# Altium schematic sheet SubsystemD_Schematic.SchDoc
size A4; SheetNumber: 1; SheetTotal: 1
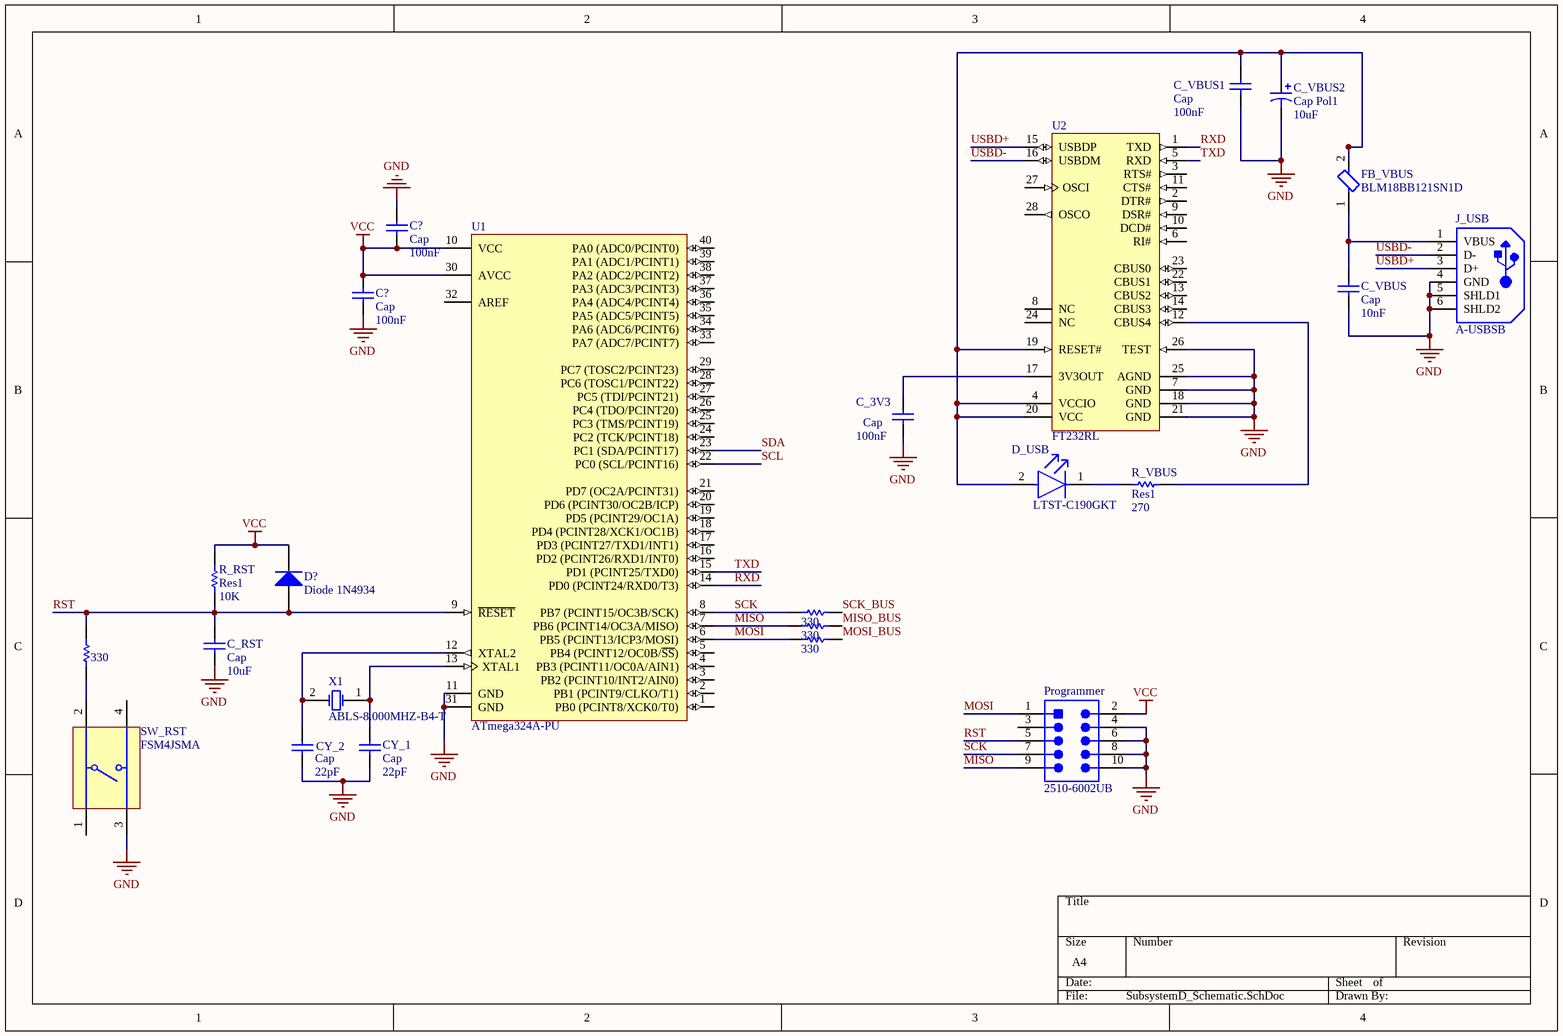
[diagram p0: SubsystemD_Schematic.SchDoc]

## Parts
(Parts that share a designator on the sheet are numbered #1, #2 ... from top to bottom, then left to right.)
BUS_R?#1  value 330  [AXIAL-0.3]  (hidden comment: Res1)
BUS_R?#2  value 330  [AXIAL-0.3]  (hidden comment: Res1)
BUS_R?#3  value 330  [AXIAL-0.3]  (hidden comment: Res1)
BUS_R?#4  value 330  [AXIAL-0.3]  (hidden comment: Res1)
C?#1  Cap  value 100nF  [RAD-0.3]
C?#2  Cap  value 100nF  [RAD-0.3]
C_3V3  Cap  value 100nF  [RAD-0.3]
C_RST  Cap  value 10uF  [RAD-0.3]
C_VBUS  Cap  value 10nF  [RAD-0.3]
C_VBUS1  Cap  value 100nF  [RAD-0.3]
C_VBUS2  Cap Pol1  value 10uF  [RB7.6-15]
CY_1  Cap  value 22pF  [RAD-0.3]
CY_2  Cap  value 22pF  [RAD-0.3]
D?  Diode 1N4934  [DO-41]
D_USB  LTST-C190GKT  [FP-LTST-C190GKT-MFG]
FB_VBUS  BLM18BB121SN1D  [FP-BLM18-0_15-t0_8-MFG]
J_USB  A-USBSB  [ASSM-A-USBSB-4_V]
Programmer  2510-6002UB  [3M-2510-6002_V]
R_RST  Res1  value 10K  [AXIAL-0.3]
R_VBUS  Res1  value 270  [AXIAL-0.3]
SW_RST  FSM4JSMA  [TECO-FSM4JSMA_V]
U1  ATmega324A-PU  [40P6]
U2  FT232RL  [FTDI-SSOP-28_M]
X1  ABLS-8.000MHZ-B4-T  [ABRA-ABLS-14.7456MHZ-B2-T_V]

## Nets
GND: C?#1.2 C?#2.1 C_3V3.1 C_RST.1 C_VBUS.1 C_VBUS1.1 C_VBUS2.2 CY_1.1 CY_2.1 J_USB.4(GND) J_USB.5(SHLD1) J_USB.6(SHLD2) Programmer.4 Programmer.6 Programmer.8 Programmer.10 SW_RST.3 U1.11(GND) U1.31(GND) U2.7(GND) U2.18(GND) U2.21(GND) U2.25(AGND) U2.26(TEST)
VCC: C?#1.1 C?#2.2 D?.2(K) Programmer.2 R_RST.2 U1.10(VCC) U1.30(AVCC)
MISO: BUS_R?#2.1 Programmer.9 U1.7(PB6_(PCINT14/OC3A/MISO))
MISO_BUS: BUS_R?#2.2
MOSI: BUS_R?#3.1 Programmer.1 U1.6(PB5_(PCINT13/ICP3/MOSI))
MOSI_BUS: BUS_R?#3.2
RST: BUS_R?#4.2 C_RST.2 D?.1(A) Programmer.5 R_RST.1 U1.9(~{RESET})
RXD: U1.14(PD0_(PCINT24/RXD0/T3)) U2.1(TXD)
SCK: BUS_R?#1.1 Programmer.7 U1.8(PB7_(PCINT15/OC3B/SCK))
SCK_BUS: BUS_R?#1.2
SCL: U1.22(PC0_(SCL/PCINT16))
SDA: U1.23(PC1_(SDA/PCINT17))
TXD: U1.15(PD1_(PCINT25/TXD0)) U2.5(RXD)
USBD+: J_USB.3(D+) U2.15(USBDP)
USBD-: J_USB.2(D-) U2.16(USBDM)
NetBUS_R?#4_1: BUS_R?#4.1 SW_RST.2
NetC_3V3_2: C_3V3.2 U2.17(3V3OUT)
NetC_VBUS1_2: C_VBUS1.2 C_VBUS2.1 D_USB.2(A) FB_VBUS.2 U2.4(VCCIO) U2.19(RESET#) U2.20(VCC)
NetC_VBUS_2: C_VBUS.2 FB_VBUS.1 J_USB.1(VBUS)
NetCY_1_2: CY_1.2 U1.13(XTAL1) X1.1(X1)
NetCY_2_2: CY_2.2 U1.12(XTAL2) X1.2(X2)
NetD_USB_1: D_USB.1(C) R_VBUS.1
NetR_VBUS_2: R_VBUS.2 U2.12(CBUS4)

Not connected (* = marked no-connect by the designer): Programmer 3; SW_RST 1 4; U1 1(PB0_(PCINT8/XCK0/T0)) 2(PB1_(PCINT9/CLKO/T1)) 3(PB2_(PCINT10/INT2/AIN0)) 4(PB3_(PCINT11/OC0A/AIN1)) 5(PB4_(PCINT12/OC0B/~{SS})) 16(PD2_(PCINT26/RXD1/INT0)) 17(PD3_(PCINT27/TXD1/INT1)) 18(PD4_(PCINT28/XCK1/OC1B)) 19(PD5_(PCINT29/OC1A)) 20(PD6_(PCINT30/OC2B/ICP)) 21(PD7_(OC2A/PCINT31)) 24(PC2_(TCK/PCINT18)) 25(PC3_(TMS/PCINT19)) 26(PC4_(TDO/PCINT20)) 27(PC5_(TDI/PCINT21)) 28(PC6_(TOSC1/PCINT22)) 29(PC7_(TOSC2/PCINT23)) 32(AREF) 33(PA7_(ADC7/PCINT7)) 34(PA6_(ADC6/PCINT6)) 35(PA5_(ADC5/PCINT5)) 36(PA4_(ADC4/PCINT4)) 37(PA3_(ADC3/PCINT3)) 38(PA2_(ADC2/PCINT2)) 39(PA1_(ADC1/PCINT1)) 40(PA0_(ADC0/PCINT0)); U2 2(DTR#) 3(RTS#) 6(RI#) 8(NC) 9(DSR#) 10(DCD#) 11(CTS#) 13(CBUS2) 14(CBUS3) 22(CBUS1) 23(CBUS0) 24(NC) 27(OSCI) 28(OSCO)

## Notes on the sheet
- Labels drawn without touching a wire or pin: SCK

## Library data of the parts
BUS_R?#1-BUS_R?#4 R_RST R_VBUS = Res1: Resistor; Published: 8-Jun-2000; LatestRevisionDate: 17-Jul-2002; LatestRevisionNote: Re-released for DXP Platform.; PackageReference: AXIAL-0.3; Publisher: Altium Limited; PackageDescription: Axial Device, Thru-Hole; 2 Leads; 0.3 in Pin Spacing
C?#1 C?#2 C_3V3 C_RST C_VBUS C_VBUS1 CY_1 CY_2 = Cap: Capacitor; Published: 8-Jun-2000; LatestRevisionDate: 17-Jul-2002; LatestRevisionNote: Re-released for DXP Platform.; PackageReference: RAD-0.3; Publisher: Altium Limited; PackageDescription: Radial Cap, Thru-Hole; 2 Leads; 0.3 in Pin Spacing
C_VBUS2 = Cap Pol1: Polarized Capacitor (Radial); Published: 8-Jun-2000; LatestRevisionDate: 17-Jul-2002; LatestRevisionNote: Re-released for DXP Platform.; PackageReference: RB7.6-15; Publisher: Altium Limited; PackageDescription: Polarized Capacitor (Radial); 2 Leads
D? = Diode 1N4934: 1 Amp Fast Recovery Rectifier; Published: 8-Jun-2000; LatestRevisionDate: 17-Jul-2002; LatestRevisionNote: Re-released for DXP Platform.; DatasheetVersion: 1999; PackageVersion: Aug-1999; PackageReference: DO-41; Publisher: Altium Limited; PackageDescription: Diode, Axial; Body 5.2 x 2.7 mm (LxDia. max), Lead Dia. 0.86 mm (max); Code_JEDEC: DO-204-AL; ComponentLink1Description: Manufacturer Link; ComponentLink1URL: http://www.fairchildsemi.com/; ComponentLink2Description: Datasheet; ComponentLink2URL: http://www.fairchildsemi.com/ds/1N%2F1N4934.pdf
D_USB = CMP-22017-000005-2: LED GREEN CLEAR CHIP SMD; Dominant Wavelength: 569nm; Reverse Voltage: 5V; Lens Color: Colorless; Viewing Angle: 130°; Voltage: 2V; Forward Current: 30mA; Power Dissipation: 100mW; Luminous Intensity: 6mcd; Number of LEDs: 1; Forward Voltage: 2.1V; Wavelength: 565nm; Test Current: 10mA; Min Operating Temperature: -55°C; Lens Style: Clear; Mount: Surface Mount; Width: 0.8mm; Packaging: Tape and Reel; Lens Transparency: Clear; Case Code (Metric): 1608; Depth: 0.8mm; Case Code (Imperial): 0603; Case/Package: 0603; Number of Pins: 2; Max Operating Temperature: 85°C; Lead Free: Lead Free; Number of Elements: 1; Length: 1.6mm; Height: 0.8mm; Package Quantity: 1; Power Rating: 100mW; Radiation Hardening: No; Illumination Color: Green; Color: Green
FB_VBUS = CMP-0686-00504-3: Chip Ferrite Bead, 0603, 120Ω @ 100MHz, 0.3Ω, 25%, 550mA; Number of Lines: 1; Max DC Current: 500mA; DC Resistance-Max: 500mR; Impedance: 120R; Shielding: Unshielded; DC Resistance (DCR): 300mR; Length: 1.6mm; Test Frequency: 100MHz; Depth: 0.8mm; Frequency: 100MHz; Core Material: Ferrite; Tolerance: 25%; Current Rating: 500mA; Lead Free: Lead Free; Packaging: Tape and Reel; Package Quantity: 1; Number of Circuits: 1; REACH SVHC: No SVHC; Max Operating Temperature: 125°C; Min Operating Temperature: -55°C; Case Code (Metric): 1608; DC Current: 500mA; Case Code (Imperial): 0603; Termination: SMD/SMT; Series: BLM18B; Case/Package: 0603; Number of Pins: 2; Radiation Hardening: No; Height: 0.8mm; RoHS Compliant: Yes; Material: Ferrite; Resistance: 500mR; Max Current Rating: 500mA; Military Standard: Not; Width: 0.8mm
J_USB = CMP-2000-05874-1: Connector Receptacle, USB Type B, Right Angle, -20 to 85 degC, 4-Pin THD, RoHS, Tray; Manufacturer: ASSMANN WSW; Gender: Female; CAD Drawing: 3DCADModel; Number of Ports: 1; Mounting Type: ThroughHole; Datasheet URL: https://datasheet.ciiva.com/11731/0900766b80da421f-11731321.pdf; Datasheet Version: 12/2009; Manufacturer URL: http://www.assmann.us/; Package Description: 4-Pin Through Hole Device, Body 16.5 x 12.04 mm; Body Orientation: RightAngle; Mounting Technology: ThroughHole; Package Reference: USBSB; Termination Method: Solder
Programmer = CMP-2000-05545-1: Male Header, Pitch 2.54 mm, 2 x 5 Position, Height 9.91 mm, Tail Length 2.84 mm, -55 to 105 degC, RoHS, Bulk; Manufacturer: 3M; Associated Product: 3505-33(1000BX)-ND / -CONNEJECTORLATCHLONGSNAP-IN; Pitch: 0.100"(2.54mm); Catalog Drawings: 6002UB,RBSeries; Dynamic Catalog: 2500Series; Connector Type: Header,Shrouded; Other Names: 5400782713 / 54007827139 / 80-6105-6503-0 / 80610565030 / MHB10G / MHB10K; Product Training Modules: IDCWiremountConnectorsPrimer; Number of Positions Loaded: All; Mating Products: CHG-2010-S01010-KEP-ND / -CONNRCPTIDC10POS24-22AWG / 3M11964-ND / -CONNSOCKET10POSIDCW/STRREL / 89110-0003-ND / -CONNSOCKET10POSIDCW/STRREL / 5110-B7A2PL-ND / -10/2R/BMSKT/.100 / MKC10E-ND / -CONN10POSIDCSOCKET10AUW/POL / MSC10E-ND / -CONN10POSIDCSOCKET15GOLD / D89110-0101HK-ND / -CONN10POSIDCSOCKETGOLDW/POL / D89110-0001HK-ND / -CONN10POSIDCSOCKETGOLD / MSPV10-ND / -CONNSOCKETPCBVERT10POS.1" / 3M9088-ND / -CONNRECEPTIDC10POS24-22AWG / More...; Number of Positions: 10; Category: Connectors,Interconnects; Datasheet Version: Rev. M, 08/2014; Datasheet URL: http://multimedia.3m.com/mws/media/330367O/3mtm-100-in-4-wall-hdr-rohs-lp-straightra-hitemp-ts0770.pdf; Series: 2500; Contact Finish: Gold; Number of Rows: 2; Standard Package: 784; Color: Gray; Package Description: Male Header, Pitch 2.54 mm, 2 x 5 Position, Height 9.91 mm, Tail Length 2.84 mm; Packaging: Bulk; Contact Type: MalePin; Mounting Technology: ThroughHole; Family: RectangularConnectors-Headers,MalePins; Contact Mating Length: 0.243"(6.17mm); Termination: Solder; Row Spacing: 0.100"(2.54mm); Package Reference: 2510-6002; Contact Finish Thickness: 30µin(0.76µm); Mounting Type: ThroughHole; Manufacturer URL: http://www.3m.com/
SW_RST = CMP-2000-05602-2: Swicth, SPST, 24 V, -35 to 85 degC, 4-Pin SMD, RoHS, Tape and Reel; Manufacturer: TE Connectivity; Switch Travel: 0.25mm; Mechanical Life: 100000Cycles; Contact Current Rating: 50mA; Operating Force: 1.57N; Actuator Material: Polyamide; Contact Resistance: 100mOhm; Voltage Rating: 24V; Illumination Type: Illuminated; Actuator Length: 0.055inch; Max Voltage Rating (DC): 12V; Case\/Package: SMD/SMT; Orientation: Straight; Datasheet URL: http://www.te.com/commerce/DocumentDelivery/DDEController?Action=showdoc&DocId=Customer+Drawing%7F2-1437565-7%7FV%7Fpdf%7FEnglish%7FENG_CD_2-1437565-7_V.pdf%7F4-1437565-2; Min Operating Temperature: -35degC; Packaging: LoosePiece; Termination: GullWing; Throw Configuration: SPST; Package Description: 4-Pin Surface Mount Device, Body 6 x 6 mm, Pitch 4.5 mm; Mounting Technology: SurfaceMount; Contact Plating: Silver; Datasheet Version: Rev. V, 02/2015; RoHSCompliant: true; Max Operating Temperature: 85degC; Length: 6mm; Voltage Rating (DC): 24V; Electrical Life: 100000Cycles; Current Rating: 50mA; Package Quantity: 750; Mount: SurfaceMount; Package Reference: FSM4JSMA; Manufacturer URL: http://www.te.com/; Width: 6mm; REACH SVHC: Unknown; Contact Material: CopperAlloy
U1 = CMP-0095-00016-2: 8-bit AVR Microcontroller, 32KB Flash, 1KB EEPROM, 2KB SRAM, 40-pin PDIP, Industrial Grade (-40°C to 85°C); ComponentLink2URL: http://www.atmel.com/dyn/resources/prod_documents/doc8272.pdf; RevisionNote: DatasheetVersion & Sch pin names updated. URLs added.; PackageReference: 40P6; PackageDescription: 40-lead (0.600"/15.24mm Wide) Plastic Dual Inline Package (PDIP); ComponentLink3Description: ATmega164A/164PA/324A/324PA/644A/644PA/1284/1284P Summary; ComponentLink3URL: http://www.atmel.com/dyn/resources/prod_documents/8272S.pdf; Code_JEDEC: MS-011-AC; ComponentLink1URL: http://www.atmel.com/; PackageVersion: revB, Sep-2001; DatasheetVersion: revC, Jun-2011; ComponentLink2Description: ATmega164A/164PA/324A/324PA/644A/644PA/1284/1284P Datasheet; ComponentLink1Description: Manufacturer URL
U2 = CMP-2000-05029-1: IC USB FS SERIAL UART 28-SSOP; Manufacturer: FTDI; Receive FIFO: 256B; Number of Channels per Chip: 1; Maximum Data Rate: 3MBd; Transmit FIFO: 128B; Dimensions: 10.2x5.3x1.75mm; Mounting Type: SurfaceMount; Height: 1.75mm; Package Type: SSOP; Datasheet Version: Rev. 1.04, 02/2006; Width: 5.3mm; Manufacturer URL: http://www.ftdichip.com/; Datasheet URL: http://datasheet.octopart.com/FT232RL-FTDI-datasheet-120501.pdf; Maximum Operating Temperature: +85degC; Minimum Operating Temperature: -40degC; Pin Count: 28; Length: 10.2mm
X1 = CMP-2000-05726-1: Low Profile Crystal, 8.0 MHz, +/- 30 ppm, -20 to 70 degC, 2-Pin SMD, RoHS, Tape and Reel; Brand: ABRACON; Case Length: 11.4mm; Frequency Stability: 50PPM; ESR: 80Ohms; Case Height: 4.2mm; Tolerance: 30PPM; Frequency: 8MHz; Case Width: 4.7mm; Load Capacitance: 18pF; Datasheet Version: 04/2011; Termination Style: SMD/SMT; Dimensions: 4.7mmWx11.4mmLx4.2mmH; Packaging: Reel; Manufacturer: ABRACON; Package URL: http://www.abracon.com/Support/PackageDrawing/Resonators/ABLS-2D.pdf; Mounting Technology: SurfaceMount; Package Reference: ABLS-14.7456MHZ-B2-T; Product Category: Crystals; Package Description: 2-Pin Surface Mount Device, Body 11.4 x 4.7 mm; Package / Case: HC-49/US; Mounting Style: SMD/SMT; Operating Temperature Range: -20Cto+70C; Series: ABLS; Factory Pack Quantity: 1000; Datasheet URL: http://www.abracon.com/Resonators/abls.pdf; Manufacturer URL: http://www.abracon.com/; RoHS: Details; Type: LowProfileMicroprocessorCrystal